# Altium schematic sheet 模拟信号输入1.SchDoc: 模拟信号输入
size A4; Author: GAOYANG
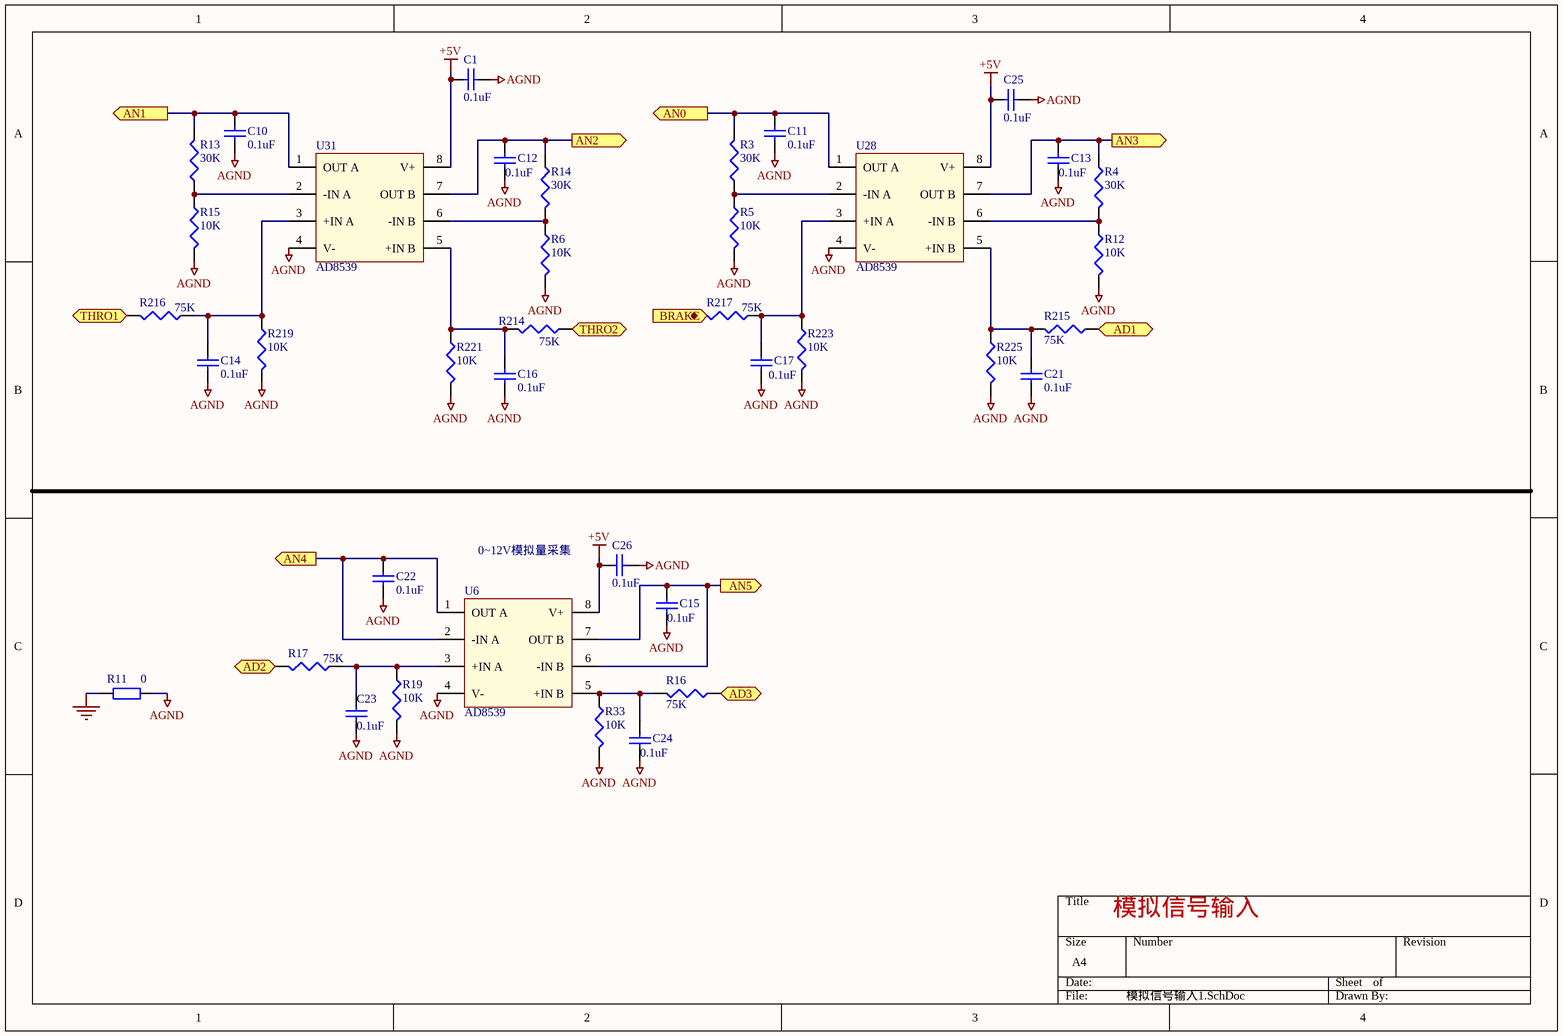
[diagram p0: 模拟信号输入1.SchDoc]

## Parts
C1  value 0.1uF  [0603-L]  (hidden comment: Cap)
C10  value 0.1uF  [0603-L]  (hidden comment: Cap)
C11  value 0.1uF  [0603-L]  (hidden comment: Cap)
C12  value 0.1uF  [0603-L]  (hidden comment: Cap)
C13  value 0.1uF  [0603-L]  (hidden comment: Cap)
C14  value 0.1uF  [0603-L]  (hidden comment: Cap)
C15  value 0.1uF  [0603-L]  (hidden comment: Cap)
C16  value 0.1uF  [0603-L]  (hidden comment: Cap)
C17  value 0.1uF  [0603-L]  (hidden comment: Cap)
C21  value 0.1uF  [0603-L]  (hidden comment: Cap)
C22  value 0.1uF  [0603-L]  (hidden comment: Cap)
C23  value 0.1uF  [0603-L]  (hidden comment: Cap)
C24  value 0.1uF  [0603-L]  (hidden comment: Cap)
C25  value 0.1uF  [0603-L]  (hidden comment: Cap)
C26  value 0.1uF  [0603-L]  (hidden comment: Cap)
R3  value 30K  [0603-L]  (hidden comment: Res3)
R4  value 30K  [0603-L]  (hidden comment: Res3)
R5  value 10K  [0603-L]  (hidden comment: Res3)
R6  value 10K  [0603-L]  (hidden comment: Res3)
R11  value 0  [RES1206]  (hidden comment: Res2)
R12  value 10K  [0603-L]  (hidden comment: Res3)
R13  value 30K  [0603-L]  (hidden comment: Res3)
R14  value 30K  [0603-L]  (hidden comment: Res3)
R15  value 10K  [0603-L]  (hidden comment: Res3)
R16  value 75K  [0603-L]  (hidden comment: Res3)
R17  value 75K  [0603-L]  (hidden comment: Res3)
R19  value 10K  [0603-L]  (hidden comment: Res3)
R33  value 10K  [0603-L]  (hidden comment: Res3)
R214  value 75K  [0603-L]  (hidden comment: Res3)
R215  value 75K  [0603-L]  (hidden comment: Res3)
R216  value 75K  [0603-L]  (hidden comment: Res3)
R217  value 75K  [0603-L]  (hidden comment: Res3)
R219  value 10K  [0603-L]  (hidden comment: Res3)
R221  value 10K  [0603-L]  (hidden comment: Res3)
R223  value 10K  [0603-L]  (hidden comment: Res3)
R225  value 10K  [0603-L]  (hidden comment: Res3)
U6  AD8539  [AD8539]
U28  AD8539  [AD8539]
U31  AD8539  [AD8539]

## Ports
AD1 (in), AD2 (in), AD3 (in), AN0 (out), AN1 (out), AN2 (out), AN3 (out), AN4 (out), AN5 (out), BRAKE (in), THRO1 (in), THRO2 (in)

## Nets
+5V: C1.2 C25.2 C26.2 U6.8(V+) U28.8(V+) U31.8(V+)
AGND: C1.1 C10.1 C11.1 C12.2 C13.2 C14.1 C15.2 C16.1 C17.1 C21.1 C22.1 C23.1 C24.1 C25.1 C26.1 R5.2 R6.2 R11.2 R12.2 R15.2 R19.2 R33.2 R219.2 R221.2 R223.2 R225.2 U6.4(V-) U28.4(V-) U31.4(V-)
GND: R11.1
AD1: R215.2 ; port AD1
AD2: R17.2 ; port AD2
AD3: R16.2 ; port AD3
AN0: C11.2 R3.2 U28.1(OUT_A) ; port AN0
AN1: C10.2 R13.2 U31.1(OUT_A) ; port AN1
AN2: C12.1 R14.1 U31.7(OUT_B) ; port AN2
AN3: C13.1 R4.1 U28.7(OUT_B) ; port AN3
AN4: C22.2 U6.1(OUT_A) U6.2(-IN_A) ; port AN4
AN5: C15.1 U6.6(-IN_B) U6.7(OUT_B) ; port AN5
BRAKE: R217.2 ; port BRAKE
THRO1: R216.2 ; port THRO1
THRO2: R214.2 ; port THRO2
NetC14_2: C14.2 R216.1 R219.1 U31.3(+IN_A)
NetC16_2: C16.2 R214.1 R221.1 U31.5(+IN_B)
NetC17_2: C17.2 R217.1 R223.1 U28.3(+IN_A)
NetC21_2: C21.2 R215.1 R225.1 U28.5(+IN_B)
NetC23_2: C23.2 R17.1 R19.1 U6.3(+IN_A)
NetC24_2: C24.2 R16.1 R33.1 U6.5(+IN_B)
NetR3_1: R3.1 R5.1 U28.2(-IN_A)
NetR4_2: R4.2 R12.1 U28.6(-IN_B)
NetR6_1: R6.1 R14.2 U31.6(-IN_B)
NetR13_1: R13.1 R15.1 U31.2(-IN_A)

## Notes on the sheet
- 0~12V模拟量采集
- 模拟信号输入

## Library data of the parts
C1 C25 C26 = Cap: Ceramic, X7R, 100V, 10%, 0603; Published: 8-Jun-2000; LatestRevisionDate: 17-Jul-2002; LatestRevisionNote: Re-released for DXP Platform.; PackageReference: RAD-0.3; Publisher: Altium Limited; PackageDescription: Radial Cap, Thru-Hole; 2 Leads; 0.3 in Pin Spacing
C10-C17 C21-C24 = Cap: Capacitor; Published: 8-Jun-2000; LatestRevisionDate: 17-Jul-2002; LatestRevisionNote: Re-released for DXP Platform.; PackageReference: RAD-0.3; Publisher: Altium Limited; PackageDescription: Radial Cap, Thru-Hole; 2 Leads; 0.3 in Pin Spacing
R3-R6 R12-R17 R19 R33 R214-R217 R219 R221 R223 R225 = Res3: Resistor; Published: 8-Jun-2000; LatestRevisionDate: 29-May-2009; LatestRevisionNote: IPC-7351 Footprint Added.; PackageReference: J1-0603; Publisher: Altium Limited; PackageDescription: Chip Resistor
R11 = Res2: Resistor; Published: 8-Jun-2000; LatestRevisionDate: 17-Jul-2002; LatestRevisionNote: Re-released for DXP Platform.; PackageReference: AXIAL-0.4; Publisher: Altium Limited; PackageDescription: Axial Device, Thru-Hole; 2 Leads; 0.4 in Pin Spacing